# EAGLE design 0Watt (EAGLE 9.6.2)
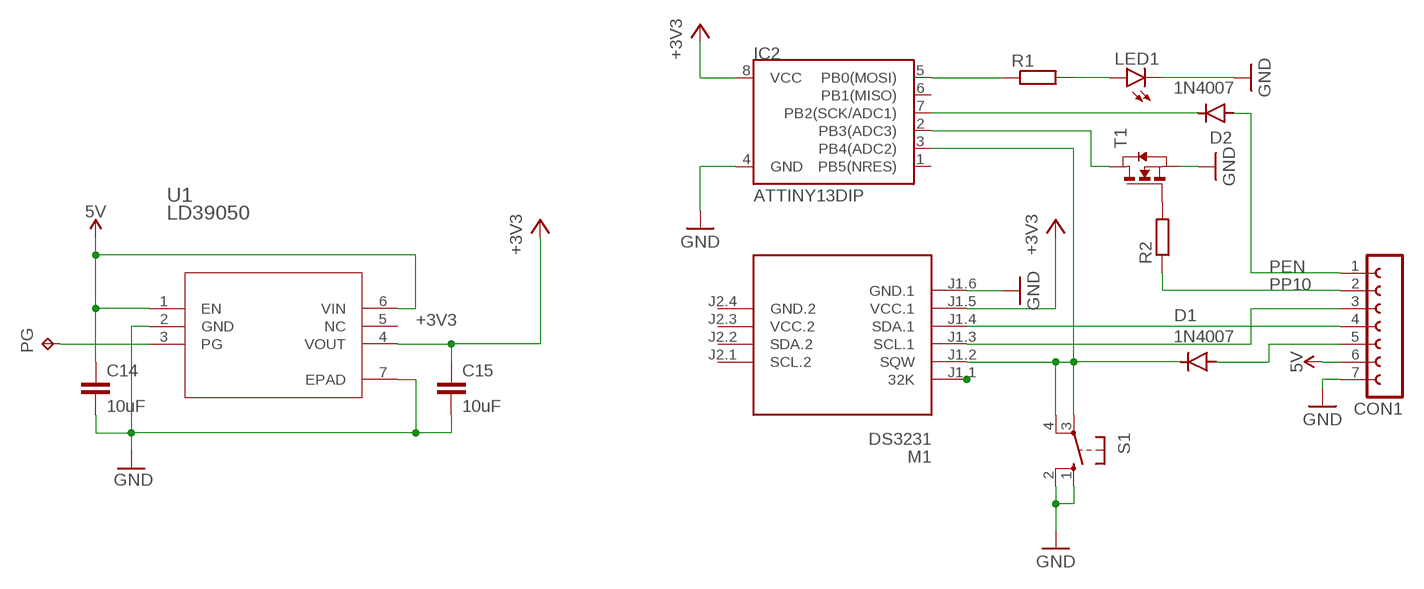
[diagram p0: schematic, sheet 1]

## Parts
C14  10uF  C-EUC1206  [C1206]
C15  10uF  C-EUC1206  [C1206]
CON1  FE07-1  [FE07]
D1  1N4007  [DO-41]
D2  1N4007  [DO-41]
IC2  ATTINY13DIP  [DIP08_MCU]
LED1  LED5MM  [LED5MM]
M1  DS3231  RTC-DS3231-AT24C32  [RTC-DS3231-AT24C32]
PG  TPB2,54  [B2,54]
R1  R-EU_0204/7  [0204/7]
R2  R-EU_R0805  [R0805]
S1  10-XX  [B3F-10XX]
T1  NMOSSOT23  [SOT-23]
U1  LD39050  LD39050PU33RDFN6_3X3_STM-M  [DFN6_3X3_STM-M]

## Nets
5V: C14.1 CON1.6 U1.1(EN) U1.6(VIN)
+3V3: C15.1 IC2.8(VCC) M1.J1.5(VCC.1) U1.4(VOUT)
GND: C14.2 C15.2 CON1.7 IC2.4(GND) LED1.K(C) M1.J1.6(GND.1) S1.1(S) S1.2(S1) T1.2(S) U1.2(GND) U1.7(EPAD)
GPIO24_: D1.C IC2.3(PB4(ADC2)) M1.J1.2(SQW) S1.3(P) S1.4(P1)
N$1: D2.C IC2.7(PB2(SCK/ADC1))
N$2: M1.J1.1(32K)
N$3: LED1.A R1.2
N$4: IC2.5(PB0(MOSI)) R1.1
N$5: R2.2 T1.3(G)
N$6: CON1.5 D1.A
N$7: CON1.3 M1.J1.3(SCL.1)
N$8: CON1.4 M1.J1.4(SDA.1)
N$9: PG.TP U1.3(PG)
N$24: IC2.2(PB3(ADC3)) T1.1(D)
PEN: CON1.1 D2.A
PP10: CON1.2 R2.1
Unconnected: IC2.1(PB5(NRES)) IC2.6(PB1(MISO)) M1.J2.1(SCL.2) M1.J2.2(SDA.2) U1.5(NC)

## Power pins joined to a net without a drawn wire
GND.2: M1.J2.4(GND.2)
VCC.2: M1.J2.3(VCC.2)

## Library data of the parts
C14 C15 = resistor:C-EU: CAPACITOR, European symbol
CON1 = con-lsta:FE07-1: FEMALE HEADER; OC_FARNELL: unknown; OC_NEWARK: unknown
D1 D2 = Diodes:1N4007: DIODE GEN PURP 1KV 1A DO41 Manufacturer's datasheet <https://www.mccsemi.com/pdf/Products/1N4001-1N4007(DO-41).pdf>; CREATED_BY: PCBLayout.com; DIGIKEY_PART_NUMBER: 1N4007MSCT-ND; MANUFACTURER: Micro Commercial Co; MPN: 1N4007; PACKAGE: DO-41
IC2 = SparkFun-Retired:ATTINY13: ATTINY13 Retired
LED1 = led:LED: LED OSRAM: - CHIPLED LG R971, LG N971, LY N971, LG Q971, LY Q971, LO R971, LY R971 LH N974, LH R974 LS Q976, LO Q976, LY Q976 LO Q996 - Hyper CHIPLED LW Q18S LB Q993, LB Q99A, LB R99A - SideLED LS A670, LO A670, LY A670, LG A670, LP A670 LB A673, LV A673, LT A673, LW A673 LH A674 LY A675 LS A676, LA A676, LO A676, LY A676, LW A676 LS A679, LY A679, LG A679 - Hyper Micro SIDELED® LS Y876, LA Y876, LO Y876, LY Y876 LT Y87S - SmartLED LW L88C, LW L88S LB L89C, LB L89S, LG L890 LS L89K, LO L89K, LY L89K LS L896, LA L896, LO L896, LY L896 - TOPLED LS T670, LO T670, LY T670, LG T670, LP T670 LSG T670, LSP T670, LSY T670, LOP T670, LYG T670 LG T671, LOG T671, LSG T671 LB T673, LV T673, LT T673, LW T673 LH T674 LS T676, LA T676, LO T676, LY T676, LB T676, LH T676, LSB T676, LW T676 LB T67C, LV T67C, LT T67C, LS T67K, LO T67K, LY T67K, LW E67C LS E67B, LA E67B, LO E67B, LY E67B, LB E67C, LV E67C, LT E67C LW T67C LS T679, LY T679, LG T679 LS T770, LO T770, LY T770, LG T770, LP T770 LB T773, LV T773, LT T773, LW T773 LH T774 LS E675, LA E675, LY E675, LS T675 LS T776, LA T776, LO T776, LY T776, LB T776 LHGB T686 LT T68C, LB T68C - Hyper Mini TOPLED® LB M676 - Mini TOPLED Santana® LG M470 LS M47K, LO M47K, LY M47K Source: http://www.osram.convergy.de LUXEON: - LUMILED® LXK2-PW12-R00, LXK2-PW12-S00, LXK2-PW14-U00, LXK2-PW14-V00 LXK2-PM12-R00, LXK2-PM12-S00, LXK2-PM14-U00 LXK2-PE12-Q00, LXK2-PE12-R00, LXK2-PE12-S00, LXK2-PE14-T00, LXK2-PE14-U00 LXK2-PB12-K00, LXK2-PB12-L00, LXK2-PB12-M00, LXK2-PB14-N00, LXK2-PB14-P00, LXK2-PB14-Q00 LXK2-PR12-L00, LXK2-PR12-M00, LXK2-PR14-Q00, LXK2-PR14-R00 LXK2-PD12-Q00, LXK2-PD12-R00, LXK2-PD12-S00 LXK2-PH12-R00, LXK2-PH12-S00 LXK2-PL12-P00, LXK2-PL12-Q00, LXK2-PL12-R00 Source: www.luxeon.com KINGBRIGHT: KA-3528ASYC Source: www.kingbright.com
M1 = diy-modules:RTC-DS3231-AT24C32: RTC Module with Battery and EEPROM based on DS3231 and AT24C32 chips Tutorial can be found here: https://edwardmallon.wordpress.com/2014/05/21/using-a-cheap-3-ds3231-rtc-at24c32-eeprom-from-ebay/ Click here to find device on ebay.com <http://www.ebay.com/sch/DS3231+AT24C32+module>
PG = testpad:TP: Test pad
R1 R2 = resistor:R-EU_: RESISTOR, European symbol
S1 = switch-omron:10-XX: OMRON SWITCH; MPN: B3F-1000; OC_FARNELL: 176432; OC_NEWARK: 36M3542
T1 = zetex:NMOSSOT23: MOS FET; OC_FARNELL: unknown; OC_NEWARK: unknown
U1 = st_ldo:LD39050PU33R; BUILT_BY: EMA_Jessica; COPYRIGHT: Copyright (C) 2018 Accelerated Designs. All rights reserved; MANUFACTURER_PART_NUMBER: LD39050PU33R; SOURCELIBRARY: STMicro_2020-01-02; VENDOR: STMicroelectronics

## Board
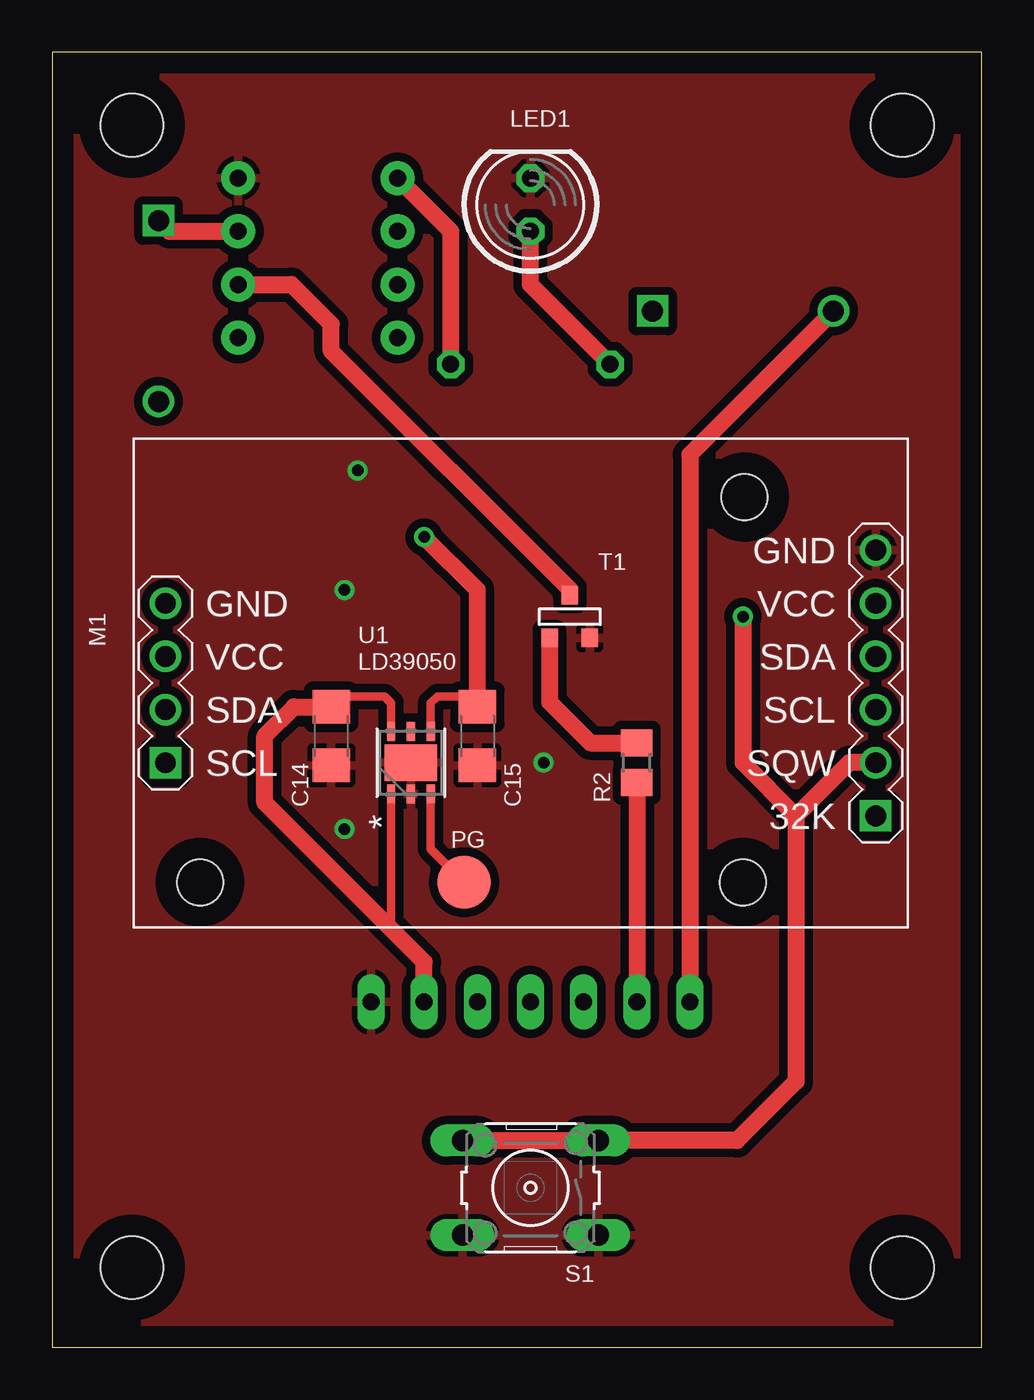
[diagram p1: board, top side]
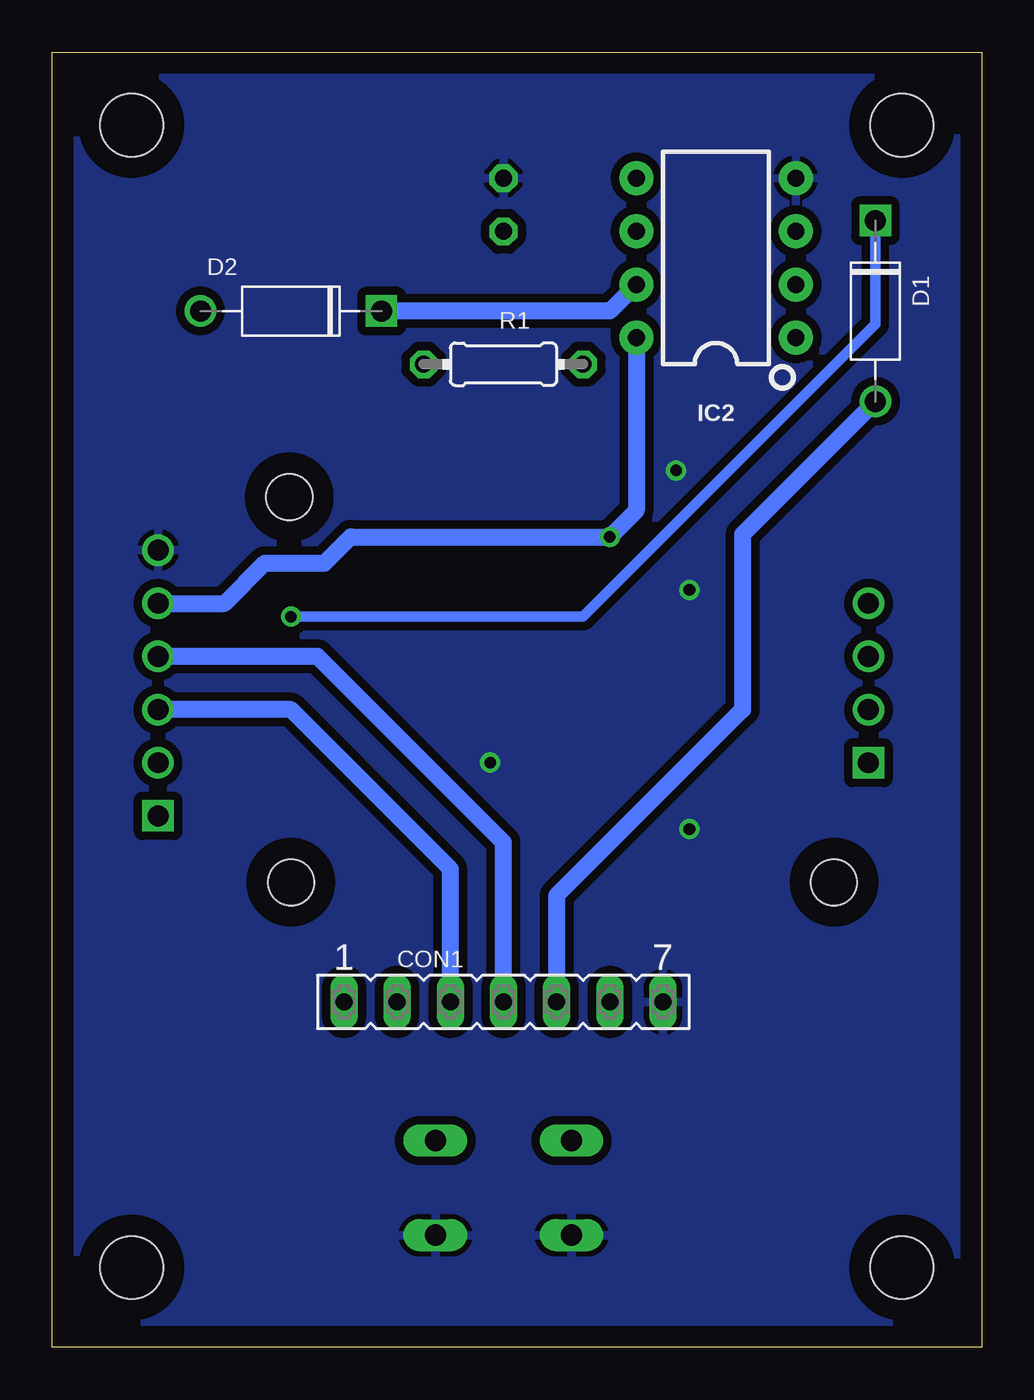
[diagram p2: board, bottom side, seen from below]

Size 44.43 x 61.9 mm. Coordinates in mm from the lower left corner, seen from the top.
Outline: 0,0 44.43,0 44.43,61.9 0,61.9 0,0
Copper layers (1*16): Top 0.035mm / dielectric 1.5mm / Bottom 0.035mm
Design rules "default": minimum track width 6mil, minimum drill 0.35mm, track to track 6mil, track to pad 6mil, pad to pad 6mil, via to via 6mil, smd to smd 6mil, copper to edge 40mil, drill to drill 6mil, minimum pad ring 10mil, minimum via ring 8mil, stop-mask expansion 4mil, vias tented up to drill 0mil, thermal gap 10mil
Holes 3 mm at 3.81,58.42 40.64,58.42 3.81,3.81 40.64,3.81

### Footprints (pad centres in the part's own frame; a part is rotated, then mirrored left to right if it is on the bottom)
C1206 = smd 1.6 x 1.8: 1 -1.4,0; 2 1.4,0
FE07 = drill 0.813 long: 1 -7.62,0; 2 -5.08,0; 3 -2.54,0; 4 0,0; 5 2.54,0; 6 5.08,0; 7 7.62,0
DO-41 = drill 1: A 4.325,0 | drill 1 square: C -4.325,0
DIP08_MCU = drill 0.813 pad 1.626: 1 -3.81,-3.81; 2 -1.27,-3.81; 3 1.27,-3.81; 4 3.81,-3.81; 5 3.81,3.81; 6 1.27,3.81; 7 -1.27,3.81; 8 -3.81,3.81
LED5MM = drill 0.813 octagon: A -1.27,0; K 1.27,0
RTC-DS3231-AT24C32 = drill 1 square: J1.1 -17.78,6.35; J2.1 16.18,3.81 | drill 1: J1.2 -17.78,3.81; J1.3 -17.78,1.27; J1.4 -17.78,-1.27; J1.5 -17.78,-3.81; J1.6 -17.78,-6.35; J2.2 16.18,1.27; J2.3 16.18,-1.27; J2.4 16.18,-3.81 | hole 2.2: -11.506,-8.89; -11.43,9.525; 14.529,9.525
B2,54 = smd 2.54 x 2.54: TP 0,0
0204/7 = drill 0.813 octagon: 1 -3.81,0; 2 3.81,0
R0805 = smd 1.3 x 1.5: 1 -0.95,0; 2 0.95,0
B3F-10XX = drill 1.016 long: 1 -3.251,2.261; 2 3.251,2.261; 3 -3.251,-2.261; 4 3.251,-2.261
SOT-23 = smd 0.787 x 0.889: 1 0.025,-1.016; 2 -0.94,1.016; 3 0.991,1.016
DFN6_3X3_STM-M = smd 0.906 x 0.399: 1 -1.503,0.95; 2 -1.503,0; 3 -1.503,-0.95; 4 1.503,-0.95; 5 1.503,0; 6 1.503,0.95 | smd 1.75 x 2.5: 7 0,0

### Placement (x,y rotation side)
C14  13.34,29.21 270 top
C15  20.32,29.21 270 top
CON1  22.86,16.51 0 bottom
D1  5.08,49.53 270 bottom
D2  33.02,49.53 180 bottom
IC2  12.7,52.07 90 bottom
LED1  22.86,54.61 90 top
M1  21.59,31.75 180 top
PG  19.68,22.23 0 top
R1  22.86,46.99 180 bottom
R2  27.94,27.94 90 top
S1  22.86,7.62 180 top
T1  24.77,34.92 180 top
U1  17.14,27.94 90 top

### Tracks (layer width: path | path; a pad name or v marks a point on that pad's centre or on a via)
5V
  Top 0.406: U1.6 16.2,30.8 15.88,31.11 13.84,31.11 C14.1 | U1.1 16.2,20
  Top 0.813: CON1.6 17.78,18.41 16.2,20 10.16,26.04 10.16,29.21 11.56,30.61 C14.1
+3V3  (via drill 0.55)
  Top 0.406: U1.4 18.09,30.8 18.41,31.11 19.82,31.11 C15.1
  Top 0.813: C15.1 20.32,36.2 v17.78,38.73
  Bottom 0.813: IC2.8 16.51,40.01 v17.78,38.73 30.16,38.73 31.42,37.48 34.27,37.48 36.2,35.56 M1.J1.5
GND  (via drill 0.55)
  other vias: 13.97,24.77 14.61,41.91 13.97,36.2 23.5,27.94
  pour Top (isolate 0.406): 0,62.23 0,0 45.72,0 45.72,62.23
  pour Bottom (isolate 0.406): 0,62.23 0,0 45.72,0 45.72,62.23
GPIO24_  (via drill 0.55)
  Top 0.813: M1.J1.2 38.1,27.94 35.56,25.4 | 35.56,25.4 35.56,12.7 32.74,9.88 S1.3 S1.4 | v33.02,34.92 33.02,27.94 35.56,25.4 | D1.C 5.59,53.34 IC2.3
  Bottom 0.508: v33.02,34.92 19.05,34.92 5.08,48.9 D1.C
N$1
  Bottom 0.813: IC2.7 17.78,49.53 D2.C
N$3
  Top 0.813: R1.2 22.86,50.8 LED1.A
N$4
  Top 0.813: IC2.5 19.05,53.34 R1.1
N$5
  Top 0.813: T1.3 23.77,30.84 25.72,28.89 R2.2
N$6
  Bottom 0.813: D1.A 11.43,38.85 11.43,30.48 20.32,21.59 CON1.5
N$7
  Bottom 0.813: CON1.3 25.4,22.86 33.02,30.48 M1.J1.3
N$8
  Bottom 0.813: CON1.4 22.86,24.13 31.75,33.02 M1.J1.4
N$9
  Top 0.406: U1.3 18.09,23.82 PG.TP
N$24
  Top 0.813: IC2.2 11.43,50.8 13.34,48.9 13.34,47.62 24.74,36.22 T1.1
PEN
  Top 0.813: D2.A 30.48,42.66 CON1.1
PP10
  Top 0.813: R2.1 CON1.2